# Altium schematic sheet PHOTO_POWER.SchDoc
size 420 x 297 mm; SheetNumber: 4; SheetTotal: 7
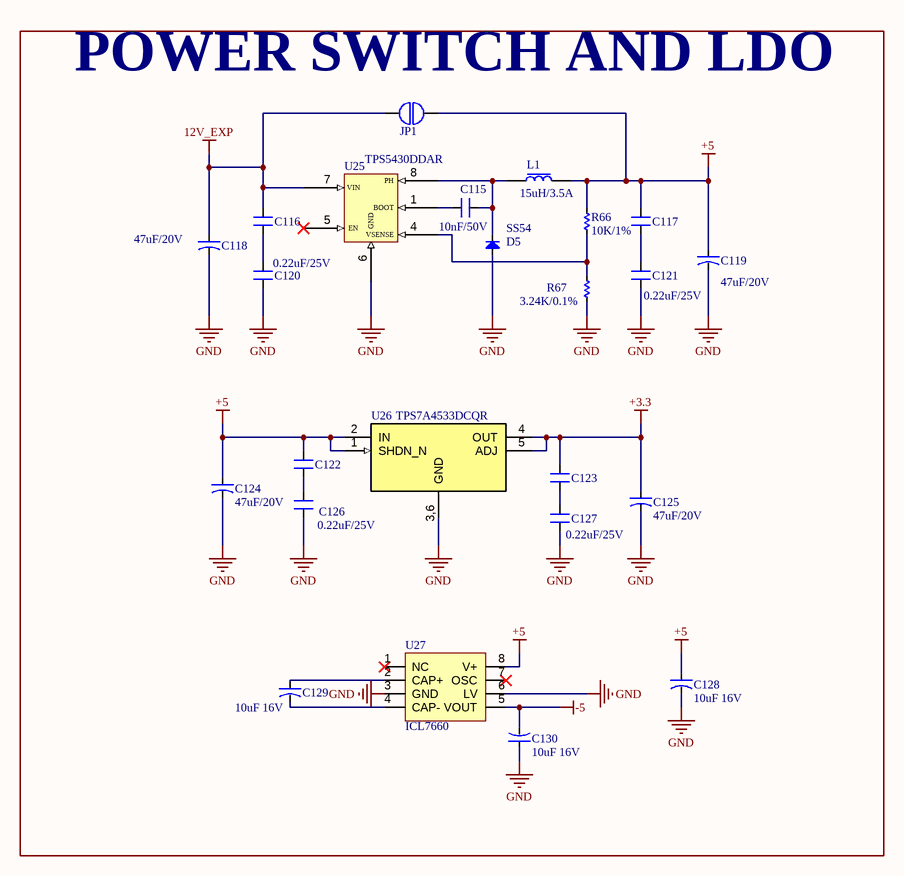
[diagram p0: PHOTO_POWER.SchDoc]

## Parts
C115  10nF/50V  [CN-SMD-0603]
C116  0.22uF/25V  [CN-SMD-0603]  (value not drawn)
C117  0.22uF/25V  [CN-SMD-0603]  (value not drawn)
C118  47uF/20V  [CAP TANT 2312]
C119  47uF/20V  [CAP TANT 2312]
C120  0.22uF/25V  [CN-SMD-0603]
C121  0.22uF/25V  [CN-SMD-0603]
C122  0.22uF/25V  [CN-SMD-0603]
C123  0.22uF/25V  [CN-SMD-0603]  (value not drawn)
C124  47uF/20V  [CAP TANT 2312]
C125  47uF/20V  [CAP TANT 2312]
C126  0.22uF/25V  [CN-SMD-0603]  (value not drawn)
C127  0.22uF/25V  [CN-SMD-0603]
C128  10uF 16V  [CAP_TANT_1206]
C129  10uF 16V  [CAP_TANT_1206]
C130  10uF 16V  [CAP_TANT_1206]
D5  SS54  [DIO-SMD-A]
JP1  JUMP2  [Jump2]  (value not drawn)
L1  15uH/3.5A  [SRP7050TA]
R66  10K/1%  [RES-SMD-0603]
R67  3.24K/0.1%  [RES-SMD-0603]
U25  TPS5430DDAR  [HSOP8]
U26  TPS7A4533DCQR  [SOT223-6]
U27  ICL7660  [SO8]

## Blocks framed on the sheet
POWER SWITCH AND LDO: C115-C130 D5 JP1 L1 R66 R67 U25-U27

## Nets
12V_EXP: C116.2 C118.1 JP1.1 U25.7(VIN)
+3.3: C123.2 C125.1 U26.4(OUT) U26.5(ADJ)
+5: C117.2 C119.1 C122.2 C124.1 C128.1 JP1.2 L1.2 R66.2 U26.1(SHDN_N) U26.2(IN) U27.8(V+)
-5: C130.2 U27.5(VOUT)
GND: C118.2 C119.2 C120.1 C121.1 C124.2 C125.2 C126.1 C127.1 C128.2 C130.1 D5.1(A) R67.1 U25.6(GND) U26.3,6(GND) U27.3(GND) U27.6(LV)
NetC115_1: C115.1 D5.2(K) L1.1 U25.8(PH)
NetC115_2: C115.2 U25.1(BOOT)
NetC116_1: C116.1 C120.2
NetC117_1: C117.1 C121.2
NetC122_1: C122.1 C126.2
NetC123_1: C123.1 C127.2
NetC129_1: C129.1 U27.2(CAP+)
NetC129_2: C129.2 U27.4(CAP-)
NetR66_1: R66.1 R67.2 U25.4(VSENSE)

Not connected (* = marked no-connect by the designer): U25 5(EN)*; U27 1(NC)* 7(OSC)*

## Notes on the sheet
- Project:
- Sub-system:
- Design by:
- Sheet title:
- Sheet
- of
- Checked by:
- Approved by:
- Revision:
- Document No:
- Size:
- Date:
- A3

## Library data of the parts
C115 = CM: CL10B103KB8NNNC; Value: 103
C116 C117 C120-C123 C126 C127 = CM: CL10B224KA8NNNC; Value: 103
C118 C119 C124 C125 = CN-ALU-SMD: TAJC476K020RNJ; Published: 8-Jun-2000; LatestRevisionDate: 17-Jul-2002; LatestRevisionNote: Re-released for DXP Platform.; PackageReference: POLAR0.8; Publisher: Altium Limited
C128-C130 = CN-ALU-SMD: TAJA106K016RNJ; Published: 8-Jun-2000; LatestRevisionDate: 17-Jul-2002; LatestRevisionNote: Re-released for DXP Platform.; PackageReference: POLAR0.8; Publisher: Altium Limited
D5 = Diode SMD: Code - JEDEC: DO-214-AB; Value: 1N5007; Published: 8-Jun-2000; Revision: July-2002: Re-released for DXP Platform.; Publisher: Altium Limited
L1 = INDUCTOR: SRP7050TA-150M
R66 = Res-SMD: ERJ-3EKF1002V; Manufacturer: Generic Components; Class: Passive; Published: 08/06/2000; Publisher: Altium Hobart Technology Centre
R67 = Res-SMD: ERA-3AEB3241V; Manufacturer: Generic Components; Class: Passive; Published: 08/06/2000; Publisher: Altium Hobart Technology Centre
U25 = TPS543X: pin to pad: 6>6+9
U27 = ICL7660: ICL7660ACBAZA-T; Creator: Nguyen Ba Bien